# Altium schematic sheet MCU-BLE.SchDoc
size B; SheetNumber: 6; SheetTotal: 15
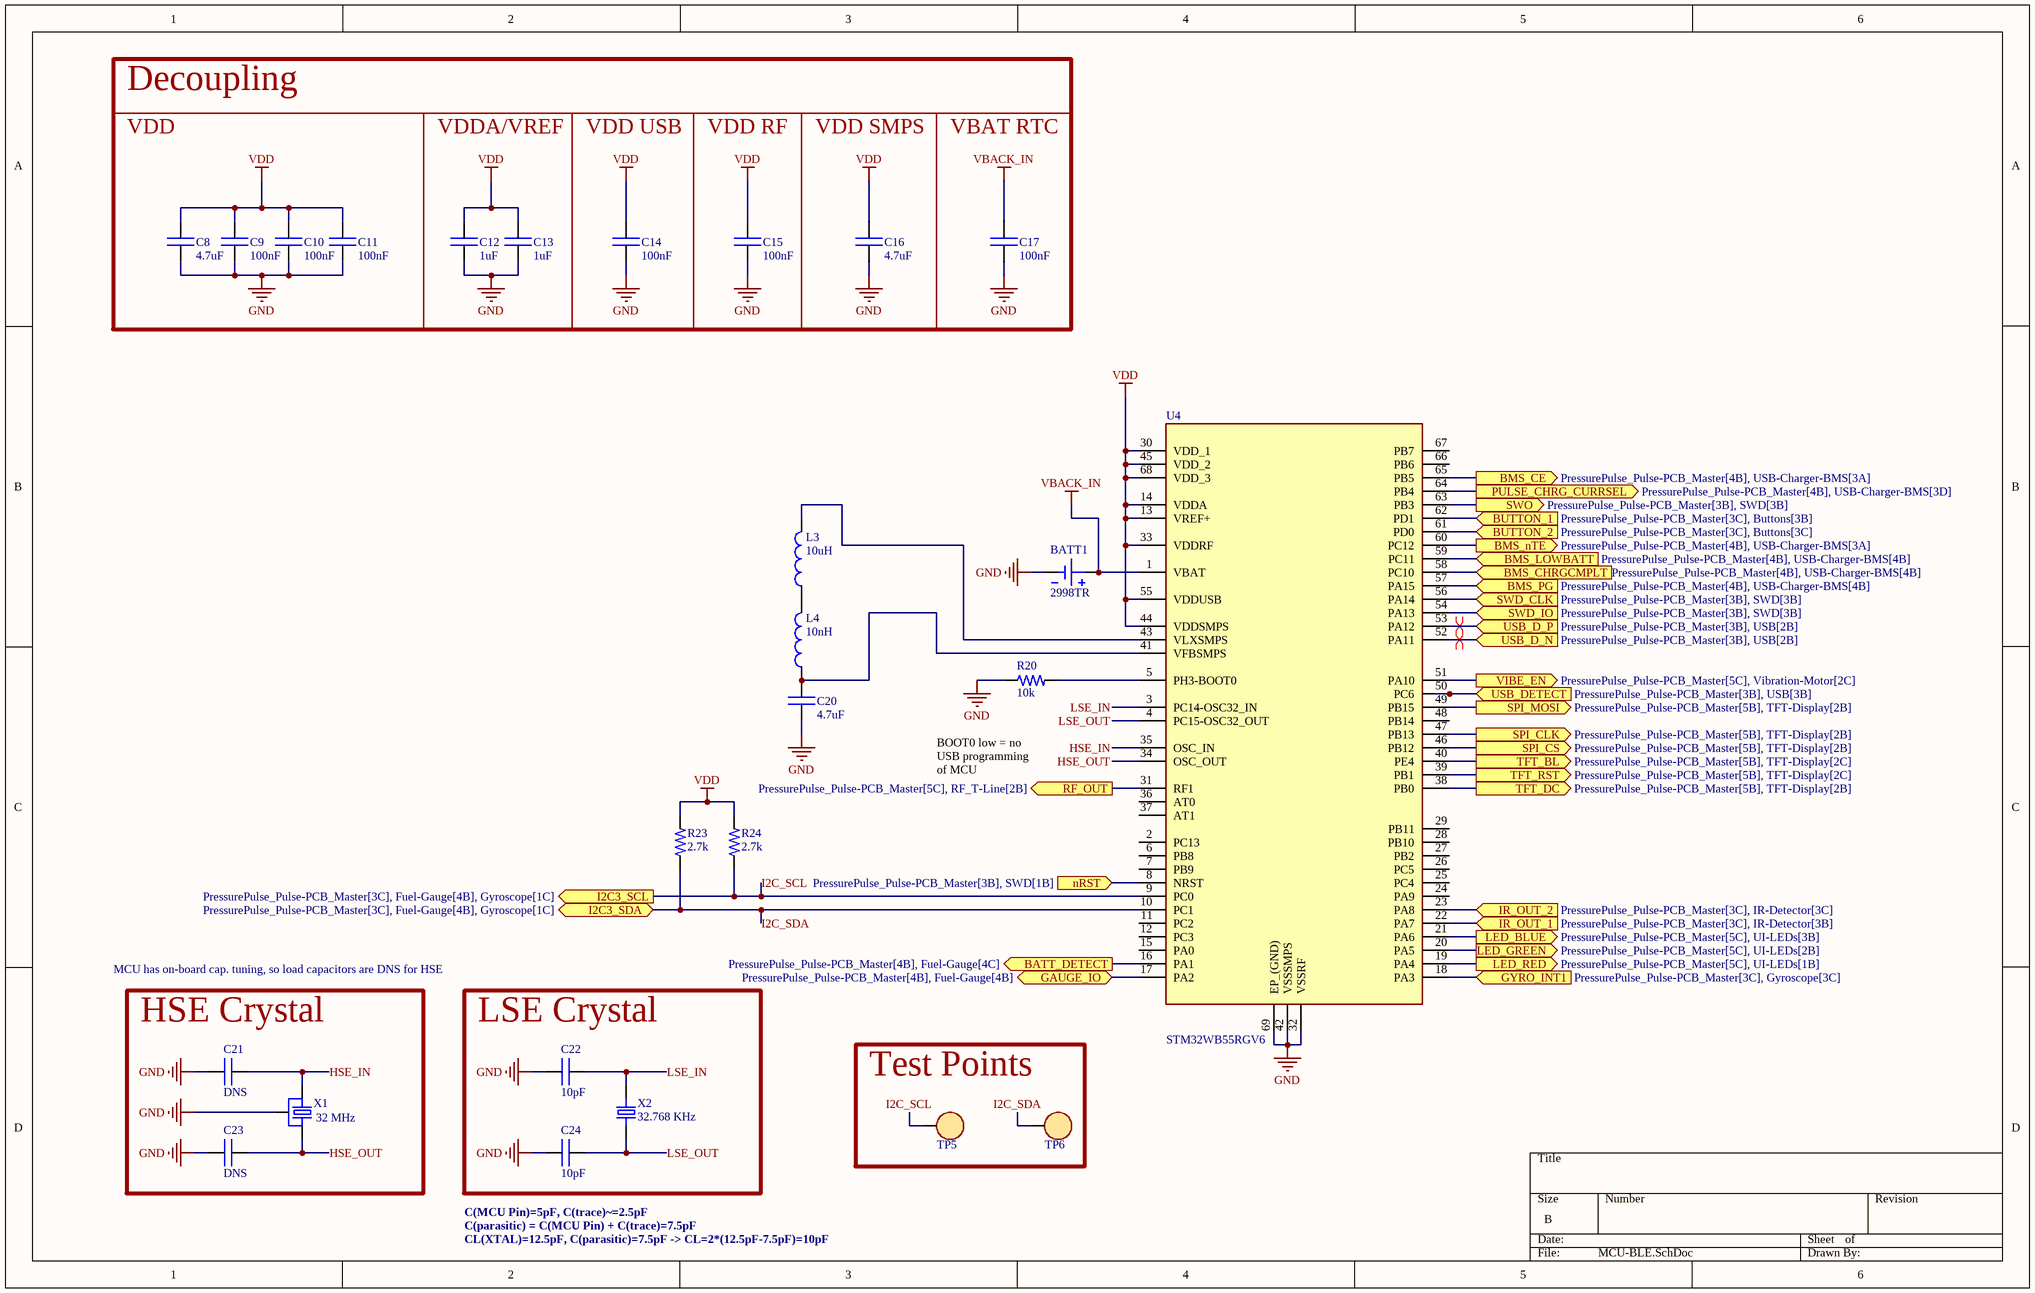
[diagram p0: MCU-BLE.SchDoc]

## Parts
BATT1  2998TR  [SR66]
C8  value 4.7uF  [0402C]  (hidden comment: CAP)
C9  value 100nF  [0402C]  (hidden comment: CAP)
C10  value 100nF  [0402C]  (hidden comment: CAP)
C11  value 100nF  [0402C]  (hidden comment: CAP)
C12  value 1uF  [0402C]  (hidden comment: CAP)
C13  value 1uF  [0402C]  (hidden comment: CAP)
C14  value 100nF  [0402C]  (hidden comment: CAP)
C15  value 100nF  [0402C]  (hidden comment: CAP)
C16  value 4.7uF  [0402C]  (hidden comment: CAP)
C17  value 100nF  [0402C]  (hidden comment: CAP)
C20  value 4.7uF  [0402C]  (hidden comment: CAP)
C21  value DNS  [0402C]  (hidden comment: CAP)
C22  value 10pF  [0402C]  (hidden comment: CAP)
C23  value DNS  [0402C]  (hidden comment: CAP)
C24  value 10pF  [0402C]  (hidden comment: CAP)
L3  value 10uH  [0805L]  (hidden comment: IND)
L4  value 10nH  [0402L]  (hidden comment: IND)
R20  value 10k  [0402R]  (hidden comment: RES)
R23  value 2.7k  [0402R]  (hidden comment: RES)
R24  value 2.7k  [0402R]  (hidden comment: RES)
TP5  RH-5019  [TP - RH-5019]  (value not drawn)
TP6  RH-5019  [TP - RH-5019]  (value not drawn)
U4  STM32WB55RGV6  [VQFN-68]
X1  Frequency: 32 MHz  [32MHZ_SMD1612-4P]  (hidden comment: XTAL-OSC_32MHz)
X2  Frequency: 32.768 KHz  [XTAL_ECS-.327-12.5-34B-TR]  (hidden comment: XTAL-OSC_32.768kHz)

## Blocks framed on the sheet
Decoupling: C8-C11
VDDA/VREF: C12 C13
VDD USB: C14
VDD RF: C15
VDD SMPS: C16
VBAT RTC: C17
HSE Crystal: C21 C23 X1
LSE Crystal: C22 C24 X2
Test Points: TP5 TP6

## Ports
BATT_DETECT (out, see PressurePulse_Pulse-PCB_Master[4B], Fuel-Gauge[4C]), BMS_CE (out, see PressurePulse_Pulse-PCB_Master[4B], USB-Charger-BMS[3A]), BMS_CHRGCMPLT (in, see PressurePulse_Pulse-PCB_Master[4B], USB-Charger-BMS[4B]), BMS_LOWBATT (in, see PressurePulse_Pulse-PCB_Master[4B], USB-Charger-BMS[4B]), BMS_nTE (out, see PressurePulse_Pulse-PCB_Master[4B], USB-Charger-BMS[3A]), BMS_PG (in, see PressurePulse_Pulse-PCB_Master[4B], USB-Charger-BMS[4B]), BUTTON_1 (in, see PressurePulse_Pulse-PCB_Master[3C], Buttons[3B]), BUTTON_2 (in, see PressurePulse_Pulse-PCB_Master[3C], Buttons[3C]), GAUGE_IO (bidir, see PressurePulse_Pulse-PCB_Master[4B], Fuel-Gauge[4B]), GYRO_INT1 (in, see PressurePulse_Pulse-PCB_Master[3C], Gyroscope[3C]), I2C3_SCL (out, see PressurePulse_Pulse-PCB_Master[3C], Fuel-Gauge[4B], Gyroscope[1C]), I2C3_SDA (bidir, see PressurePulse_Pulse-PCB_Master[3C], Fuel-Gauge[4B], Gyroscope[1C]), IR_OUT_1 (in, see PressurePulse_Pulse-PCB_Master[3C], IR-Detector[3B]), IR_OUT_2 (in, see PressurePulse_Pulse-PCB_Master[3C], IR-Detector[3C]), LED_BLUE (out, see PressurePulse_Pulse-PCB_Master[5C], UI-LEDs[3B]), LED_GREEN (out, see PressurePulse_Pulse-PCB_Master[5C], UI-LEDs[2B]), LED_RED (out, see PressurePulse_Pulse-PCB_Master[5C], UI-LEDs[1B]), nRST (in, see PressurePulse_Pulse-PCB_Master[3B], SWD[1B]), PULSE_CHRG_CURRSEL (out, see PressurePulse_Pulse-PCB_Master[4B], USB-Charger-BMS[3D]), RF_OUT (out, see PressurePulse_Pulse-PCB_Master[5C], RF_T-Line[2B]), SPI_CLK (out, see PressurePulse_Pulse-PCB_Master[5B], TFT-Display[2B]), SPI_CS (out, see PressurePulse_Pulse-PCB_Master[5B], TFT-Display[2B]), SPI_MOSI (out, see PressurePulse_Pulse-PCB_Master[5B], TFT-Display[2B]), SWD_CLK (in, see PressurePulse_Pulse-PCB_Master[3B], SWD[3B]), SWD_IO (in, see PressurePulse_Pulse-PCB_Master[3B], SWD[3B]), SWO (out, see PressurePulse_Pulse-PCB_Master[3B], SWD[3B]), TFT_BL (out, see PressurePulse_Pulse-PCB_Master[5B], TFT-Display[2C]), TFT_DC (out, see PressurePulse_Pulse-PCB_Master[5B], TFT-Display[2B]), TFT_RST (out, see PressurePulse_Pulse-PCB_Master[5B], TFT-Display[2C]), USB_D_N (in, see PressurePulse_Pulse-PCB_Master[3B], USB[2B]), USB_D_P (in, see PressurePulse_Pulse-PCB_Master[3B], USB[2B]), USB_DETECT (in, see PressurePulse_Pulse-PCB_Master[3B], USB[3B]), VIBE_EN (out, see PressurePulse_Pulse-PCB_Master[5C], Vibration-Motor[2C])

## Nets
GND: BATT1.N(NEG) C8.1 C9.1 C10.1 C11.1 C12.1 C13.1 C14.1 C15.1 C16.1 C17.1 C20.1 C21.2 C22.2 C23.2 C24.2 R20.1 U4.32(VSSRF) U4.42(VSSSMPS) U4.69(EP_(GND)) X1.GND
VBACK_IN: BATT1.P(POS) C17.2 U4.1(VBAT)
VDD: C8.2 C9.2 C10.2 C11.2 C12.2 C13.2 C14.2 C15.2 C16.2 R23.2 R24.2 U4.13(VREF+) U4.14(VDDA) U4.30(VDD_1) U4.33(VDDRF) U4.44(VDDSMPS) U4.45(VDD_2) U4.55(VDDUSB) U4.68(VDD_3)
BATT_DETECT: U4.16(PA1) ; port BATT_DETECT
BMS_CE: U4.65(PB5) ; port BMS_CE
BMS_CHRGCMPLT: U4.58(PC10) ; port BMS_CHRGCMPLT
BMS_LOWBATT: U4.59(PC11) ; port BMS_LOWBATT
BMS_nTE: U4.60(PC12) ; port BMS_nTE
BMS_PG: U4.57(PA15) ; port BMS_PG
BUTTON_1: U4.62(PD1) ; port BUTTON_1
BUTTON_2: U4.61(PD0) ; port BUTTON_2
GAUGE_IO: U4.17(PA2) ; port GAUGE_IO
GYRO_INT1: U4.18(PA3) ; port GYRO_INT1
HSE_IN: C21.1 U4.35(OSC_IN) X1.1
HSE_OUT: C23.1 U4.34(OSC_OUT) X1.3
I2C_SCL: R24.1 TP5.1 U4.9(PC0) ; port I2C3_SCL
I2C_SDA: R23.1 TP6.1 U4.10(PC1) ; port I2C3_SDA
IR_OUT_1: U4.22(PA7) ; port IR_OUT_1
IR_OUT_2: U4.23(PA8) ; port IR_OUT_2
LED_BLUE: U4.21(PA6) ; port LED_BLUE
LED_GREEN: U4.20(PA5) ; port LED_GREEN
LED_RED: U4.19(PA4) ; port LED_RED
LSE_IN: C22.1 U4.3(PC14-OSC32_IN) X2.2
LSE_OUT: C24.1 U4.4(PC15-OSC32_OUT) X2.1
nRST: U4.8(NRST) ; port nRST
PULSE_CHRG_CURRSEL: U4.64(PB4) ; port PULSE_CHRG_CURRSEL
RF_OUT: U4.31(RF1) ; port RF_OUT
SPI_CLK: U4.47(PB13) ; port SPI_CLK
SPI_CS: U4.46(PB12) ; port SPI_CS
SPI_MOSI: U4.49(PB15) ; port SPI_MOSI
SWD_CLK: U4.56(PA14) ; port SWD_CLK
SWD_IO: U4.54(PA13) ; port SWD_IO
SWO: U4.63(PB3) ; port SWO
TFT_BL: U4.40(PE4) ; port TFT_BL
TFT_DC: U4.38(PB0) ; port TFT_DC
TFT_RST: U4.39(PB1) ; port TFT_RST
USB_D_N: U4.52(PA11) ; port USB_D_N
USB_D_P: U4.53(PA12) ; port USB_D_P
USB_DETECT: U4.50(PC6) ; port USB_DETECT
VIBE_EN: U4.51(PA10) ; port VIBE_EN
NetC20_2: C20.2 L4.1 U4.41(VFBSMPS)
NetL3_1: L3.1 L4.2
NetL3_2: L3.2 U4.43(VLXSMPS)
NetR20_2: R20.2 U4.5(PH3-BOOT0)

Not connected (* = marked no-connect by the designer): U4 2(PC13) 6(PB8) 7(PB9) 11(PC2) 12(PC3) 15(PA0) 24(PA9) 25(PC4) 26(PC5) 27(PB2) 28(PB10) 29(PB11) 36(AT0) 37(AT1) 48(PB14) 66(PB6) 67(PB7)

## Layout directives
differential pair: USB_D_N, USB_D_P

## Notes on the sheet
- VDD
- BOOT0 low = no USB programming of MCU
- MCU has on-board cap. tuning, so load capacitors are DNS for HSE
- CL(XTAL)=12.5pF, C(parasitic)=7.5pF -> CL=2*(12.5pF-7.5pF)=10pF
- C(MCU Pin)=5pF, C(trace)~=2.5pF
- C(parasitic) = C(MCU Pin) + C(trace)=7.5pF

## Library data of the parts
BATT1 = COIN CELL BATT - SR66: Battery Holder (Open) Coin, 6.8mm, 1 Cell PC Pin; MFR: Keystone Electronics; Value: DNS; MFR PN: 2998TR; JLCPCB PN: DNS
C8-C17 C20 C21 C23 = CAP: Capaicitor; MFR: *; MFR PN: *
C22 C24 = CAP: Capaicitor; MFR PN: FN15N100J500PNG; MFR: *; JLCPCB PN: C328913
L3 L4 = IND: INDUCTOR; Footprint: *
  L4: JLCPCB PN: C963995
R20 R23 R24 = RES: Resistor; MFR PN: *; MFR: *; JLCPCB PN: *
TP5 TP6 = TEST POINT: MFR: ronghe; MFR PN: RH-5019; Value: RH-5019; JLCPCB PN: C5199800
U4 = STM32WB55RGV6: ARM Microcontrollers - MCU Ultra-low-power dual core Arm Cortex-M4 MCU 64 MHz, Cortex-M0 32MHz with 1 Mbyte Flash, BLE, 802.15.4, USB, LCD, AES-256; MFR: STMicroelectronics; Value: STM32WB55RGV6; JLCPCB PN: C401505; Footprint: *
X1 = XTAL-OSC_32MHz: SMD Tuning Fork Crystal; MFR PN: Murata; Value: XRCMD32M000FXP50R0; Type: SMD; JLCPCB PN: C341820
X2 = XTAL-OSC_32.768kHz: 32.768kHz 12.5pF ±20ppm SMD3215-2P  Crystals ROHS; MFR: CITIZEN; MFR PN: CM315D32768DZFT; Value: CM315D32768DZFT; JLCPCB PN: C182057